# EAGLE board COM-TC (EAGLE 8.4.3), part 1 of 2
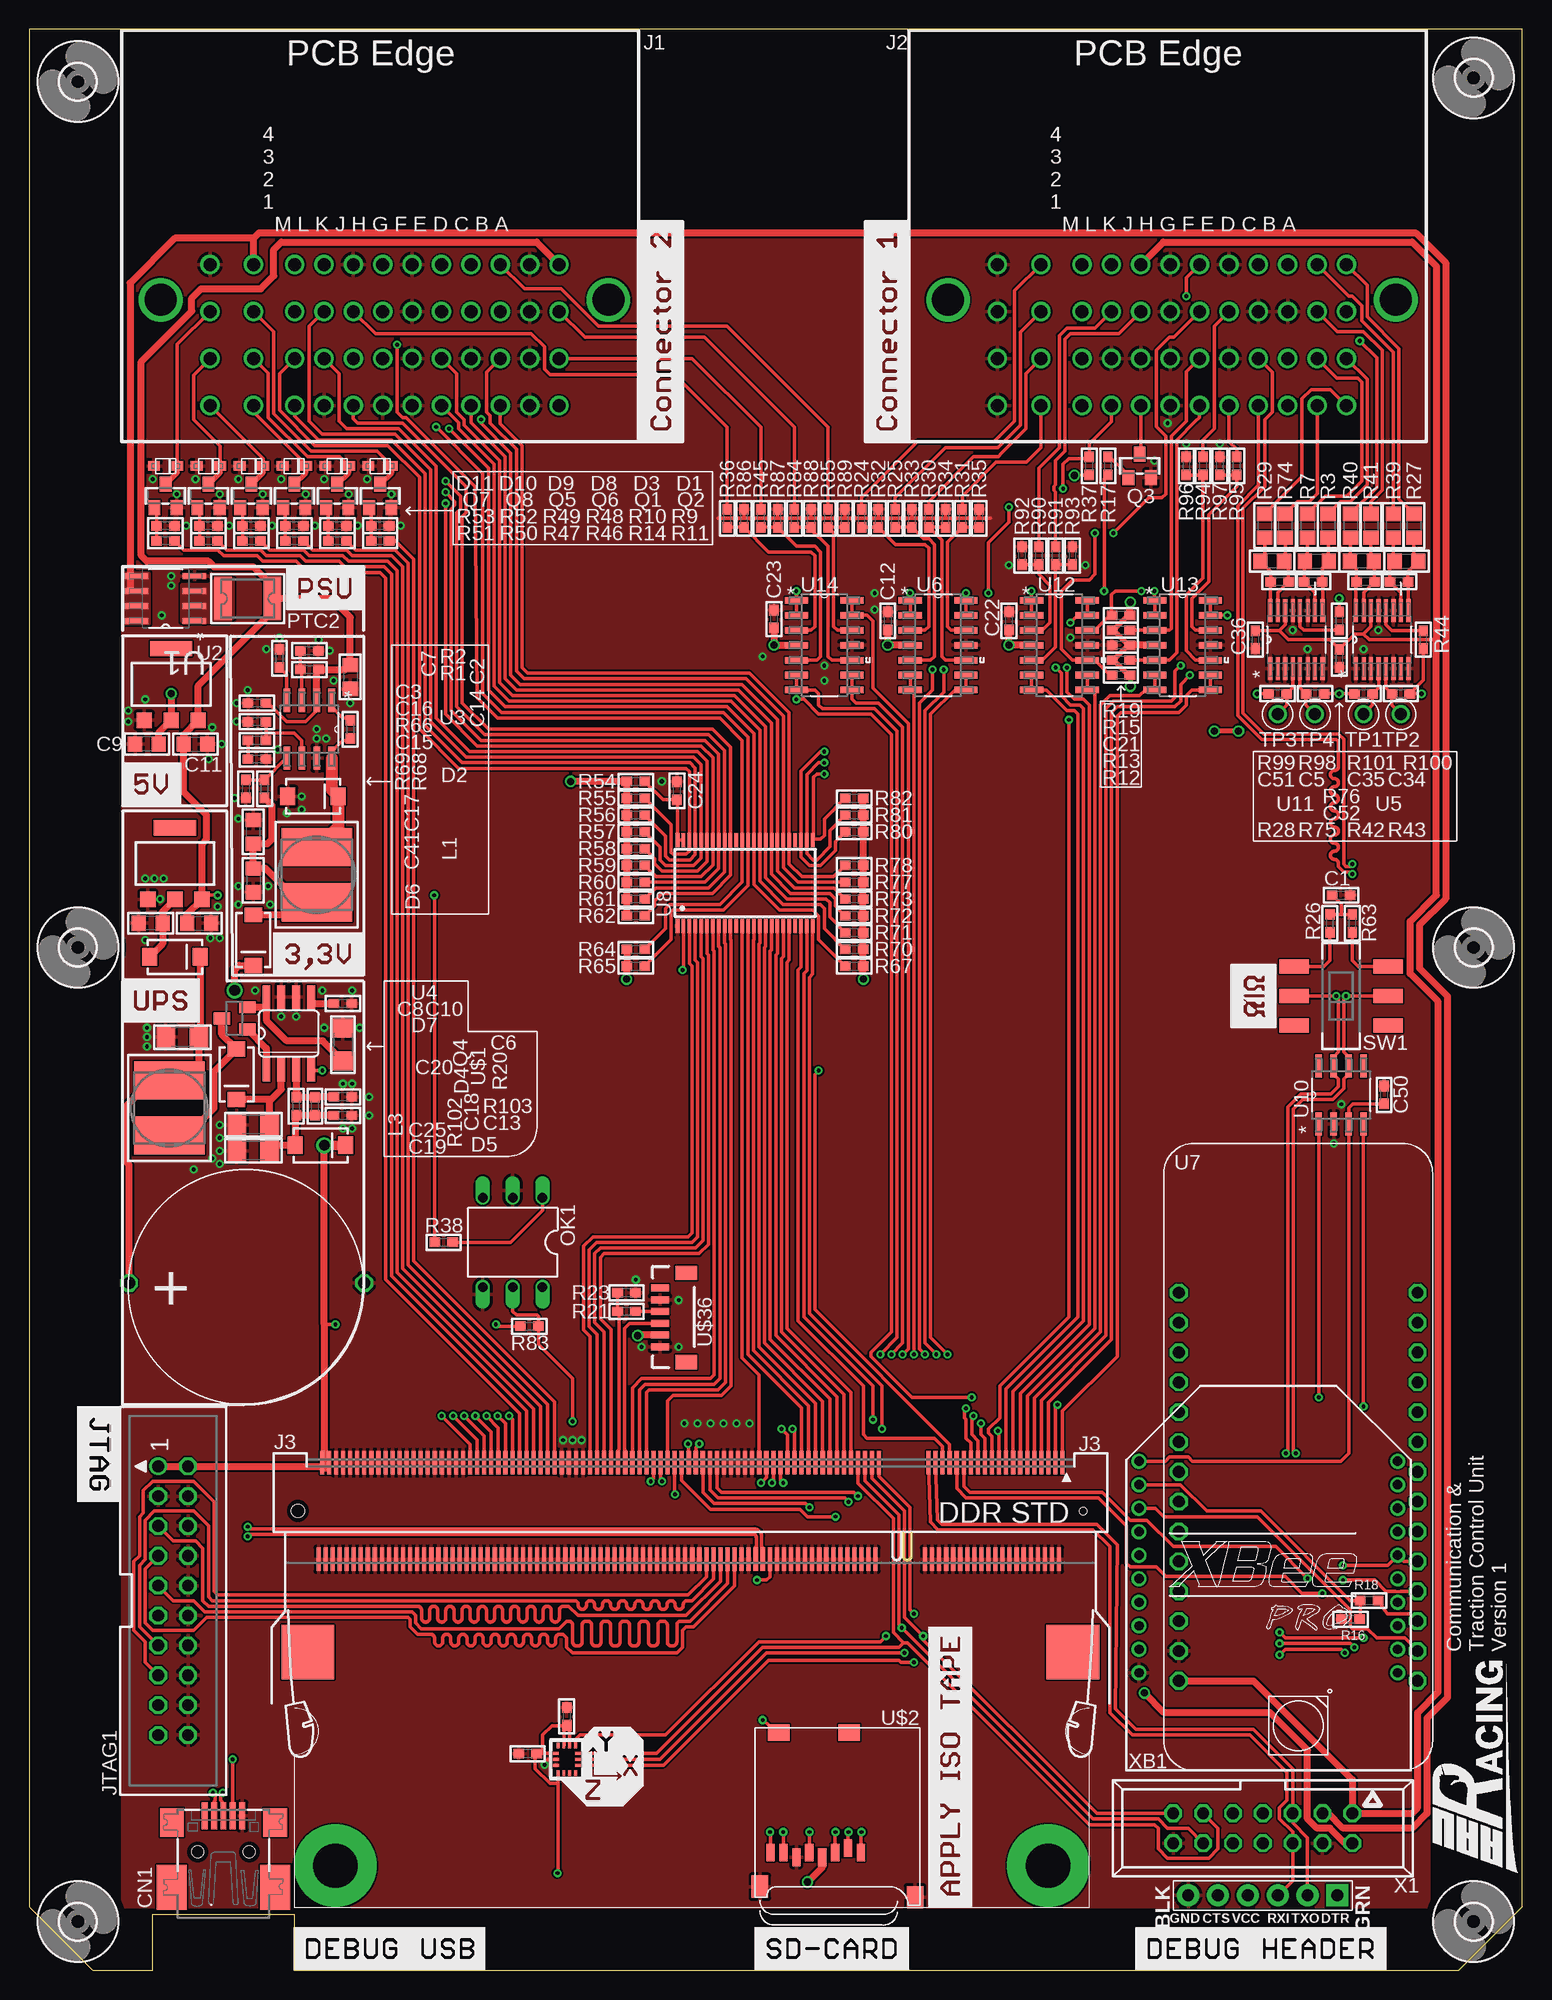
[diagram p4: board, top side]
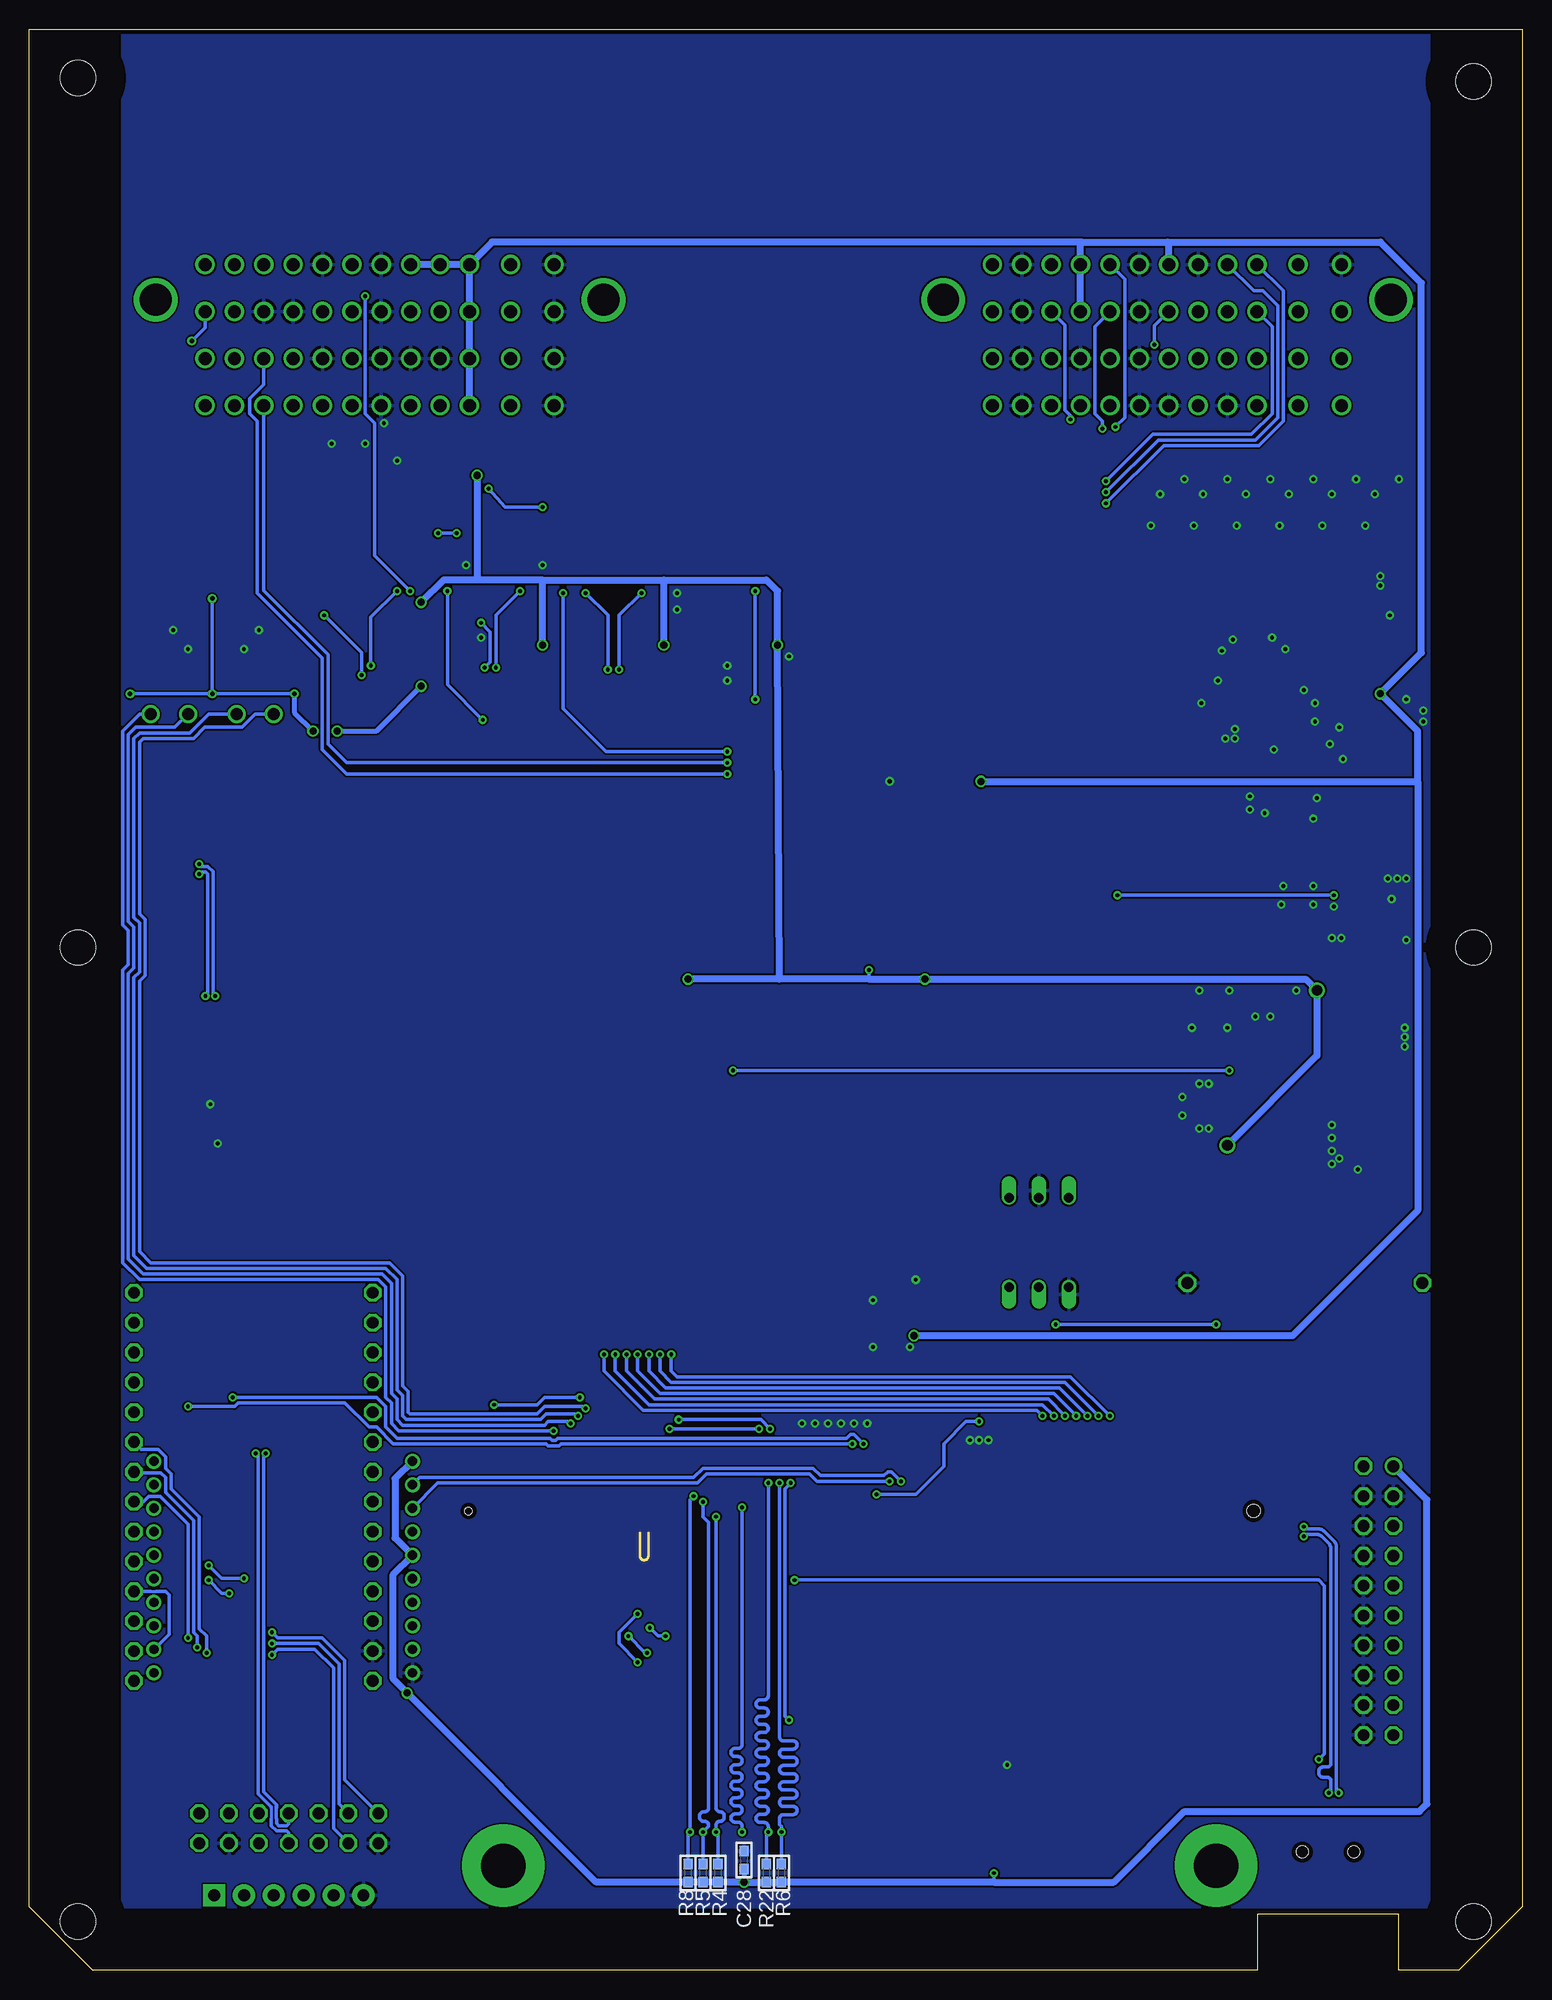
[diagram p5: board, bottom side, seen from below]

Size 127 x 165.1 mm. Coordinates in mm from the lower left corner, seen from the top.
Outline: 0,165.1 0,5.4 5.4,0 10.48,0 10.48,4.76 22.54,4.76 22.54,0 121.6,0 127,5.4 127,165.1 0,165.1
Copper layers (1*16): Top 0.0356mm / dielectric 1.5011mm / Bottom 0.0356mm
Design rules "LaenPCBOrder": minimum track width 6mil, minimum drill 13mil, track to track 6mil, track to pad 6mil, pad to pad 6mil, via to via 6mil, smd to smd 6mil, copper to edge 15mil, drill to drill 6mil, minimum pad ring 7mil, minimum via ring 7mil, stop-mask expansion 3mil, vias tented up to drill 0mil, thermal gap 10mil

## Footprints (pad centres in the part's own frame; a part is rotated, then mirrored left to right if it is on the bottom)
_0603 = smd 0.9 x 0.8: 1 -0.762,0; 2 0.762,0
_0805 = smd 1.2 x 1.3: 1 -1.016,0; 2 1.016,0
SUPERCAP = drill 1 octagon: P$1 -9.93,0.35; P$3 10.07,0.35
1206 = smd 1.6 x 1.8: 1 -1.4,0; 2 1.4,0
USB-MINIB_LARGER = smd 0.5 x 2.308: D+ 0,4.064; D- -0.8,4.064; GND 1.6,4.064; ID 0.8,4.064; VBUS -1.6,4.064 | smd 2.54 x 3.81: GND1 -4.4,-2; GND4 4.4,-2 | smd 2 x 2.4: GND2 -4.4,3.5; GND3 4.4,3.5 | hole 1: -2.2,1; 2.2,1
SOD-323F = smd 1 x 0.8: A -1,0; C 1,0
SMA-DIODE = smd 1.27 x 1.47: A -2.15,0; C 2.15,0
3,0 = hole 3: 0,0
AUTOCONNECTOR = drill 1.1: A1 15.22,-6.92; A2 15.22,-2.92; A3 15.22,1.08; A4 15.22,5.08; B1 12.72,-6.92; B2 12.72,-2.92; B3 12.72,1.08; B4 12.72,5.08; C1 10.22,-6.92; C2 10.22,-2.92; C3 10.22,1.08; C4 10.22,5.08; D1 7.72,-6.92; D2 7.72,-2.92; D3 7.72,1.08; D4 7.72,5.08; E1 5.22,-6.92; E2 5.22,-2.92; E3 5.22,1.08; E4 5.22,5.08; F1 2.72,-6.92; F2 2.72,-2.92; F3 2.72,1.08; F4 2.72,5.08; G1 0.22,-6.92; G2 0.22,-2.92; G3 0.22,1.08; G4 0.22,5.08; H1 -2.28,-6.92; H2 -2.28,-2.92; H3 -2.28,1.08; H4 -2.28,5.08; J1 -4.78,-6.92; J2 -4.78,-2.92; J3 -4.78,1.08; J4 -4.78,5.08; K1 -7.28,-6.92; K2 -7.28,-2.92; K3 -7.28,1.08; K4 -7.28,5.08; L1 -10.78,-6.92; L2 -10.78,-2.92; L3 -10.78,1.08; L4 -10.78,5.08; M1 -14.48,-6.92; M2 -14.48,-2.92; M3 -14.48,1.08; M4 -14.48,5.08 | drill 2.7: SHIELD1 19.42,2.08; SHIELD2 -18.68,2.08
SODIMM-CONNECTOR-2.5V = smd 0.35 x 2: 1 28.84,18.07; 2 28.54,9.87; 3 28.24,18.07; 4 27.94,9.87; 5 27.64,18.07; 6 27.34,9.87; 7 27.04,18.07; 8 26.74,9.87; 9 26.44,18.07; 10 26.14,9.87; 11 25.84,18.07; 12 25.54,9.87; 13 25.24,18.07; 14 24.94,9.87; 15 24.64,18.07; 16 24.34,9.87; 17 24.04,18.07; 18 23.74,9.87; 19 23.44,18.07; 20 23.14,9.87; 21 22.84,18.07; 22 22.54,9.87; 23 22.24,18.07; 24 21.94,9.87; 25 21.64,18.07; 26 21.34,9.87; 27 21.04,18.07; 28 20.74,9.87; 29 20.44,18.07; 30 20.14,9.87; 31 19.84,18.07; 32 19.54,9.87; 33 19.24,18.07; 34 18.94,9.87; 35 18.64,18.07; 36 18.34,9.87; 37 18.04,18.07; 38 17.74,9.87; 39 17.44,18.07; 40 17.14,9.87; 41 13.24,18.07; 42 12.94,9.87; 43 12.64,18.07; 44 12.34,9.87; 45 12.04,18.07; 46 11.74,9.87; 47 11.44,18.07; 48 11.14,9.87; 49 10.84,18.07; 50 10.54,9.87; 51 10.24,18.07; 52 9.94,9.87; 53 9.64,18.07; 54 9.34,9.87; 55 9.04,18.07; 56 8.74,9.87; 57 8.44,18.07; 58 8.14,9.87; 59 7.84,18.07; 60 7.54,9.87; 61 7.24,18.07; 62 6.94,9.87; 63 6.64,18.07; 64 6.34,9.87; 65 6.04,18.07; 66 5.74,9.87; 67 5.44,18.07; 68 5.14,9.87; 69 4.84,18.07; 70 4.54,9.87; 71 4.24,18.07; 72 3.94,9.87; 73 3.64,18.07; 74 3.34,9.87; 75 3.04,18.07; 76 2.74,9.87; 77 2.44,18.07; 78 2.14,9.87; 79 1.84,18.07; 80 1.54,9.87; 81 1.24,18.07; 82 0.94,9.87; 83 0.64,18.07; 84 0.34,9.87; 85 0.04,18.07; 86 -0.26,9.87; 87 -0.56,18.07; 88 -0.86,9.87; 89 -1.16,18.07; 90 -1.46,9.87; 91 -1.76,18.07; 92 -2.06,9.87; 93 -2.36,18.07; 94 -2.66,9.87; 95 -2.96,18.07; 96 -3.26,9.87; 97 -3.56,18.07; 98 -3.86,9.87; 99 -4.16,18.07; 100 -4.46,9.87; 101 -4.76,18.07; 102 -5.06,9.87; 103 -5.36,18.07; 104 -5.66,9.87; 105 -5.96,18.07; 106 -6.26,9.87; 107 -6.56,18.07; 108 -6.86,9.87; 109 -7.16,18.07; 110 -7.46,9.87; 111 -7.76,18.07; 112 -8.06,9.87; 113 -8.36,18.07; 114 -8.66,9.87; 115 -8.96,18.07; 116 -9.26,9.87; 117 -9.56,18.07; 118 -9.86,9.87; 119 -10.16,18.07; 120 -10.46,9.87; 121 -10.76,18.07; 122 -11.06,9.87; 123 -11.36,18.07; 124 -11.66,9.87; 125 -11.96,18.07; 126 -12.26,9.87; 127 -12.56,18.07; 128 -12.86,9.87; 129 -13.16,18.07; 130 -13.46,9.87; 131 -13.76,18.07; 132 -14.06,9.87; 133 -14.36,18.07; 134 -14.66,9.87; 135 -14.96,18.07; 136 -15.26,9.87; 137 -15.56,18.07; 138 -15.86,9.87; 139 -16.16,18.07; 140 -16.46,9.87; 141 -16.76,18.07; 142 -17.06,9.87; 143 -17.36,18.07; 144 -17.66,9.87; 145 -17.96,18.07; 146 -18.26,9.87; 147 -18.56,18.07; 148 -18.86,9.87; 149 -19.16,18.07; 150 -19.46,9.87; 151 -19.76,18.07; 152 -20.06,9.87; 153 -20.36,18.07; 154 -20.66,9.87; 155 -20.96,18.07; 156 -21.26,9.87; 157 -21.56,18.07; 158 -21.86,9.87; 159 -22.16,18.07; 160 -22.46,9.87; 161 -22.76,18.07; 162 -23.06,9.87; 163 -23.36,18.07; 164 -23.66,9.87; 165 -23.96,18.07; 166 -24.26,9.87; 167 -24.56,18.07; 168 -24.86,9.87; 169 -25.16,18.07; 170 -25.46,9.87; 171 -25.76,18.07; 172 -26.06,9.87; 173 -26.36,18.07; 174 -26.66,9.87; 175 -26.96,18.07; 176 -27.26,9.87; 177 -27.56,18.07; 178 -27.86,9.87; 179 -28.16,18.07; 180 -28.46,9.87; 181 -28.76,18.07; 182 -29.06,9.87; 183 -29.36,18.07; 184 -29.66,9.87; 185 -29.96,18.07; 186 -30.26,9.87; 187 -30.56,18.07; 188 -30.86,9.87; 189 -31.16,18.07; 190 -31.46,9.87; 191 -31.76,18.07; 192 -32.06,9.87; 193 -32.36,18.07; 194 -32.66,9.87; 195 -32.96,18.07; 196 -33.26,9.87; 197 -33.56,18.07; 198 -33.86,9.87; 199 -34.16,18.07; 200 -34.46,9.87 | smd 4.5 x 4.6: M1 29.74,1.97; M2 -35.36,1.97 | drill 3.75 pad 7: P$1 -33.02,-16.192; P$2 27.622,-16.192 | hole 0.6: 30.59,13.97 | hole 1.1: -36.21,13.97
FTDI_DEVICE_SIDE = drill 1.016 pad 1.88 square: P$1 -6.35,0 | drill 1.016 pad 1.88: P$2 -3.81,0; P$3 -1.27,0; P$4 1.27,0; P$5 3.81,0; P$6 6.35,0
JTAG-ARM = drill 1: 1 -11.43,-1.27 | drill 1 octagon: 2 -11.43,1.27; 3 -8.89,-1.27; 4 -8.89,1.27; 5 -6.35,-1.27; 6 -6.35,1.27; 7 -3.81,-1.27; 8 -3.81,1.27; 9 -1.27,-1.27; 10 -1.27,1.27; 11 1.27,-1.27; 12 1.27,1.27; 13 3.81,-1.27; 14 3.81,1.27; 15 6.35,-1.27; 16 6.35,1.27; 17 8.89,-1.27; 18 8.89,1.27; 19 11.43,-1.27; 20 11.43,1.27
INDUCTOR_6X6MM_TDK_VLC6045 = smd 3.25 x 6: P$1 -2.35,0; P$2 2.35,0
DIL06 = drill 0.813 offset: 1 -2.54,-3.81; 2 0,-3.81; 3 2.54,-3.81; 4 2.54,3.81; 5 0,3.81; 6 -2.54,3.81
PTC1812 = smd 1.5 x 3.7: P$1 -2.1,0; P$2 2.1,0
SOT23-WIDE = smd 1 x 1.27: 1 -0.95,-1; 2 0.95,-1; 3 0,1
SOT23 = smd 1 x 1.4: 1 -0.95,-1.1; 2 0.95,-1.1; 3 0,1.1
DPDT_SMT_JS202011SCQN = smd 1.2 x 2.5: P$1 -2.5,-4; P$2 0,-4; P$3 2.5,-4; P$4 2.5,4; P$5 0,4; P$6 -2.5,4
TESTPOINT_0.040IN = drill 1.016: TESTPOINT 0,0
SOIC127P600X175-8N = smd 1.981 x 0.508: 1 -2.464,1.905; 2 -2.464,0.635; 3 -2.464,-0.635; 4 -2.464,-1.905; 5 2.464,-1.905; 6 2.464,-0.635; 7 2.464,0.635; 8 2.464,1.905
SOT223-R = smd 1.3 x 1.3: 1 -2.3,-3.05; 2 0,-3.05; 3 2.3,-3.05 | smd 3.6 x 1.3: 4 0,3.05
SOIC127P600X175-8N' = smd 1.981 x 0.559: 1 -2.464,1.905; 2 -2.464,0.635; 3 -2.464,-0.635; 4 -2.464,-1.905; 5 2.464,-1.905; 6 2.464,-0.635; 7 2.464,0.635; 8 2.464,1.905
SOP63P600X175-16N = smd 1.981 x 0.356: 1 -2.464,2.235; 2 -2.464,1.575; 3 -2.464,0.965; 4 -2.464,0.305; 5 -2.464,-0.305; 6 -2.464,-0.965; 7 -2.464,-1.575; 8 -2.464,-2.235; 9 2.464,-2.235; 10 2.464,-1.575; 11 2.464,-0.965; 12 2.464,-0.305; 13 2.464,0.305; 14 2.464,0.965; 15 2.464,1.575; 16 2.464,2.235
SOIC127P600X175-14N = smd 1.981 x 0.559: 1 -2.362,3.81; 2 -2.362,2.54; 3 -2.362,1.27; 4 -2.362,0; 5 -2.362,-1.27; 6 -2.362,-2.54; 7 -2.362,-3.81; 8 2.362,-3.81; 9 2.362,-2.54; 10 2.362,-1.27; 11 2.362,0; 12 2.362,1.27; 13 2.362,2.54; 14 2.362,3.81
LOPY = drill 1 octagon: 3,3V 10.16,12.7; 5 10.16,-15.24; 5V 10.16,17.78; 6 10.16,-12.7; 7 10.16,-10.16; 8 10.16,-7.62; 9 -10.16,17.78; 10 10.16,-2.54; 11 10.16,-5.08; 12 10.16,0; 13 10.16,2.54; 14 10.16,7.62; 15 10.16,5.08; 16 -10.16,0; 17 10.16,10.16; 18 -10.16,-7.62; 20 -10.16,-10.16; 21 -10.16,5.08; 22 -10.16,-5.08; 23 -10.16,10.16; 24 -10.16,7.62; 34 -10.16,2.54; 38 -10.16,-2.54; 39 -10.16,-12.7; 40 -10.16,15.24; 41 -10.16,12.7; 42 -10.16,-15.24; GND 10.16,15.24
TSSOP48 = smd 0.3 x 1.2: 1 -5.5,-3.4; 2 -5,-3.4; 3 -4.5,-3.4; 4 -4,-3.4; 5 -3.5,-3.4; 6 -3,-3.4; 7 -2.5,-3.4; 8 -2,-3.4; 9 -1.5,-3.4; 10 -1,-3.4; 11 -0.5,-3.4; 12 0,-3.4; 13 0.5,-3.4; 14 1,-3.4; 15 1.5,-3.4; 16 2,-3.4; 17 2.5,-3.4; 18 3,-3.4; 19 3.5,-3.4; 20 4,-3.4; 21 4.5,-3.4; 22 5,-3.4; 23 5.5,-3.4; 24 6,-3.4; 25 6,3.9; 26 5.5,3.9; 27 5,3.9; 28 4.5,3.9; 29 4,3.9; 30 3.5,3.9; 31 3,3.9; 32 2.5,3.9; 33 2,3.9; 34 1.5,3.9; 35 1,3.9; 36 0.5,3.9; 37 0,3.9; 38 -0.5,3.9; 39 -1,3.9; 40 -1.5,3.9; 41 -2,3.9; 42 -2.5,3.9; 43 -3,3.9; 44 -3.5,3.9; 45 -4,3.9; 46 -4.5,3.9; 47 -5,3.9; 48 -5.5,3.9
LGA14L_DOT_INDICATOR = smd 0.45 x 0.25: 1 -1.175,0.75; 2 -1.175,0.25; 3 -1.175,-0.25; 4 -1.175,-0.75; 8 1.175,-0.75; 9 1.175,-0.25; 10 1.175,0.25; 11 1.175,0.75 | smd 0.25 x 0.45: 5 -0.5,-0.925; 6 0,-0.925; 7 0.5,-0.925; 12 0.5,0.925; 13 0,0.925; 14 -0.5,0.925
SO08 = smd 0.66 x 2.032: 1 -1.905,-3.073; 2 -0.635,-3.073; 3 0.635,-3.073; 4 1.905,-3.073; 5 1.905,3.073; 6 0.635,3.073; 7 -0.635,3.073; 8 -1.905,3.073
MICROSD = smd 0.7 x 1.5: 1 9,-10.64; 2 7.9,-10.24; 3 6.8,-10.64; 4 5.7,-11.04; 5 4.6,-10.64; 6 3.5,-11.04; 7 2.4,-10.64; 8 1.3,-10.64 | smd 1.8 x 1.4: CD1 2,-0.44; CD2 8,-0.44 | smd 1.4 x 1.9: MT1 0.4,-13.54; MT2 13.6,-14.44
EM406 = smd 0.6 x 1.55: 1 0,0; 2 1,0; 3 2,0; 4 3,0; 5 4,0; 6 5,0 | smd 1.2 x 1.8: P$1 -1.3,-2.225; P$2 6.3,-2.225
057-014-1 = drill 1 octagon: 1 -7.62,-1.27; 2 -7.62,1.27; 3 -5.08,-1.27; 4 -5.08,1.27; 5 -2.54,-1.27; 6 -2.54,1.27; 7 0,-1.27; 8 0,1.27; 9 2.54,-1.27; 10 2.54,1.27; 11 5.08,-1.27; 12 5.08,1.27; 13 7.62,-1.27; 14 7.62,1.27
XBEE-PRO = drill 0.8 pad 1.27: 1 -11,9; 2 -11,7; 3 -11,5; 4 -11,3; 5 -11,1; 6 -11,-1; 7 -11,-3; 8 -11,-5; 9 -11,-7; 10 -11,-9; 11 11,-9; 12 11,-7; 13 11,-5; 14 11,-3; 15 11,-1; 16 11,1; 17 11,3; 18 11,5; 19 11,7; 20 11,9

## Placement (x,y rotation side)
C1  47n  [_0603]  111.6,91.44 180 top
C2  4,7u  [_0805]  27.3,110.01 270 top
C3  10n  [_0603]  19.37,107.79 180 top
C4  SUPERCAP  [SUPERCAP]  18.41,58.1 0 top
C5  1n  [_0603]  109.22,118.11 180 top
C6  100n  [_0603]  26.67,82.23 0 top
C7  10n  [_0603]  21.27,111.6 90 top
C8  22u  [_0805]  10.32,89.06 180 top
C9  22u  [_0805]  10,104.3 180 top
C10  10u  [_0805]  14.45,89.06 0 top
C11  10u  [_0805]  14.13,104.3 0 top
C12  100n  [_0603]  73.03,114.78 270 top
C13  100n  [_0603]  26.67,72.71 0 top
C14  100n  [_0603]  27.3,105.57 90 top
C15  1n  [_0603]  19.37,104.62 180 top
C16  47p  [_0603]  19.37,106.2 180 top
C17  47u  [_0805]  19.05,96.84 90 top
C18  47p  [_0603]  24.29,73.5 270 top
C19  100u 6v3  [1206]  19.05,69.69 180 top
C20  150u 6v3  [1206]  13.02,79.38 180 top
C21  100n  [_0603]  92.87,112.71 0 top
C22  100n  [_0603]  83.34,114.78 270 top
C23  100n  [_0603]  63.34,114.94 270 top
C24  100n  [_0603]  55.09,100.33 90 top
C25  100u 6v3  [1206]  19.05,71.91 180 top
C26  100n  [_0603]  42.39,18.41 180 top
C27  100n  [_0603]  45.72,21.59 90 top
C28  100n  [_0603]  66.2,9.37 90 bottom
C34  1n  [_0603]  116.52,118.11 180 top
C35  1n  [_0603]  113.67,118.11 0 top
C36  100n  [_0603]  104.3,113.19 270 top
C41  47u  [_0805]  19.05,92.71 270 top
C50  100n  [_0603]  115.25,74.45 90 top
C51  1n  [_0603]  106.36,118.11 0 top
C52  100n  [_0603]  111.44,111.6 270 top
CN1  [USB-MINIB_LARGER]  16.51,9.05 0 top
D1  [SOD-323F]  29.84,127.95 0 top
D2  BA340A  [SMA-DIODE]  24.13,99.85 0 top
D3  [SOD-323F]  26.19,127.95 0 top
D4  BA340A  [SMA-DIODE]  17.62,76.2 270 top
D5  BA340A  [SMA-DIODE]  24.77,70.17 0 top
D6  BA340A  [SMA-DIODE]  19.05,87.63 270 top
D7  BA340A  [SMA-DIODE]  12.38,86.2 0 top
D8  [SOD-323F]  22.54,127.95 0 top
D9  [SOD-323F]  18.89,127.95 0 top
D10  [SOD-323F]  15.24,127.95 0 top
D11  [SOD-323F]  11.59,127.95 0 top
H1  MOUNT-HOLE3.0  [3,0]  4.13,160.66 0 top
H2  MOUNT-HOLE3.0  [3,0]  4.13,87 0 top
H3  MOUNT-HOLE3.0  [3,0]  4.13,4.13 0 top
H4  MOUNT-HOLE3.0  [3,0]  122.87,4.13 0 top
H5  MOUNT-HOLE3.0  [3,0]  122.87,160.97 0 top
H6  MOUNT-HOLE3.0  [3,0]  122.87,87 0 top
J1  CON1  [AUTOCONNECTOR]  29.84,140.02 0 top
J2  CON1  [AUTOCONNECTOR]  96.84,140.02 0 top
J3  SO-DIMM-CPU  [SODIMM-CONNECTOR-2.5V]  59.05,25.08 0 top
J4  FTDI_DEVICE  [FTDI_DEVICE_SIDE]  104.93,6.35 180 top
JTAG1  JTAG-ARM  [JTAG-ARM]  12.22,31.43 270 top
L1  SRN6045TA-680M  [INDUCTOR_6X6MM_TDK_VLC6045]  24.45,93.19 270 top
L3  SRN6045TA-220M  [INDUCTOR_6X6MM_TDK_VLC6045]  11.91,73.34 270 top
OK1  4N33  [DIL06]  41.12,61.91 180 top
PTC2  [PTC1812]  18.57,116.68 180 top
Q1  [SOT23-WIDE]  26.19,125.41 0 top
Q2  [SOT23-WIDE]  29.84,125.41 0 top
Q3  [SOT23-WIDE]  94.46,127.95 0 top
Q4  PMV20XNE  [SOT23]  17.46,80.96 90 top
Q5  [SOT23-WIDE]  18.89,125.41 0 top
Q6  [SOT23-WIDE]  22.54,125.41 0 top
Q7  [SOT23-WIDE]  11.59,125.41 0 top
Q8  [SOT23-WIDE]  15.24,125.41 0 top
R1  332k  [_0603]  23.81,110.65 180 top
R2  68k1  [_0603]  23.81,112.24 0 top
R3  10k 0W5  [_0805]  110.49,122.87 270 top
R4  4k7  [_0603]  68.42,8.26 90 bottom
R5  4k7  [_0603]  69.69,8.26 90 bottom
R6  4k7  [_0603]  63.02,8.26 90 bottom
R7  10k 0W5  [_0805]  108.74,122.87 270 top
R8  4k7  [_0603]  70.96,8.26 90 bottom
R9  500  [_0603]  29.84,122.87 0 top
R10  500  [_0603]  26.19,122.87 0 top
R11  220  [_0603]  29.84,121.6 0 top
R12  10k  [_0603]  92.87,110.17 180 top
R13  10k  [_0603]  92.87,111.44 0 top
R14  220  [_0603]  26.19,121.6 0 top
R15  10k  [_0603]  92.87,113.98 0 top
R16  976  [_0603]  112.39,29.84 180 top
R17  500  [_0603]  91.76,127.95 270 top
R18  499  [_0603]  113.98,31.43 0 top
R19  10k  [_0603]  92.87,115.25 180 top
R20  35m  [1206]  26.67,78.74 270 top
R21  499  [_0603]  50.8,56.04 0 top
R22  4k7  [_0603]  64.29,8.26 90 bottom
R23  976  [_0603]  50.8,57.63 180 top
R24  20k  [_0603]  70.8,123.51 270 top
R25  20k  [_0603]  73.66,123.51 270 top
R26  60  [_0603]  110.65,89.06 270 top
R27  10k 0W5  [_0805]  117.79,122.87 270 top
R28  1k  [_0603]  106.2,108.58 180 top
R29  10k 0W5  [_0805]  105.09,122.87 270 top
R30  20k  [_0603]  76.52,123.51 270 top
R31  20k  [_0603]  79.38,123.51 270 top
R32  38k2  [_0603]  72.23,123.51 270 top
R33  38k2  [_0603]  75.09,123.51 270 top
R34  38k2  [_0603]  77.95,123.51 270 top
R35  38k2  [_0603]  80.8,123.51 270 top
R36  20k  [_0603]  59.37,123.51 270 top
R37  10k  [_0603]  90.17,127.95 90 top
R38  560  [_0603]  35.24,61.91 0 top
R39  10k 0W5  [_0805]  116.05,122.87 270 top
R40  10k 0W5  [_0805]  112.39,122.87 270 top
R41  10k 0W5  [_0805]  114.14,122.87 270 top
R42  1k  [_0603]  113.51,108.58 180 top
R43  1k  [_0603]  116.68,108.58 0 top
R44  1k  [_0603]  118.59,113.19 270 top
R45  20k  [_0603]  62.23,123.51 270 top
R46  220  [_0603]  22.54,121.6 0 top
R47  220  [_0603]  18.89,121.6 0 top
R48  500  [_0603]  22.54,122.87 0 top
R49  500  [_0603]  18.89,122.87 0 top
R50  220  [_0603]  15.24,121.6 0 top
R51  220  [_0603]  11.59,121.6 0 top
R52  500  [_0603]  15.24,122.87 0 top
R53  500  [_0603]  11.59,122.87 0 top
R54  200k  [_0603]  51.59,101.12 180 top
R55  220  [_0603]  51.59,99.69 0 top
R56  220  [_0603]  51.59,98.27 0 top
R57  220  [_0603]  51.59,96.84 0 top
R58  220  [_0603]  51.59,95.41 0 top
R59  220  [_0603]  51.59,93.98 0 top
R60  220  [_0603]  51.59,92.55 0 top
R61  220  [_0603]  51.59,91.12 0 top
R62  220  [_0603]  51.59,89.69 0 top
R63  60  [_0603]  112.55,89.06 90 top
R64  220  [_0603]  51.59,86.84 0 top
R65  220  [_0603]  51.59,85.41 0 top
R66  29k4  [_0603]  19.37,103.03 0 top
R67  220  [_0603]  70.17,85.41 180 top
R68  10k2  [_0603]  20,100.49 90 top
R69  2k7  [_0603]  18.41,100.49 270 top
R70  220  [_0603]  70.17,86.84 180 top
R71  220  [_0603]  70.17,88.27 180 top
R72  220  [_0603]  70.17,89.69 180 top
R73  220  [_0603]  70.17,91.12 180 top
R74  10k 0W5  [_0805]  106.84,122.87 270 top
R75  1k  [_0603]  109.38,108.58 0 top
R76  1k  [_0603]  111.44,114.78 90 top
R77  220  [_0603]  70.17,92.55 180 top
R78  220  [_0603]  70.17,93.98 180 top
R80  220  [_0603]  70.17,96.84 180 top
R81  220  [_0603]  70.17,98.27 180 top
R82  220  [_0603]  70.17,99.69 180 top
R83  500  [_0603]  42.55,54.77 0 top
R84  20k  [_0603]  65.09,123.51 270 top
R85  20k  [_0603]  67.94,123.51 270 top
R86  38k2  [_0603]  60.8,123.51 270 top
R87  38k2  [_0603]  63.66,123.51 270 top
R88  38k2  [_0603]  66.52,123.51 270 top
R89  38k2  [_0603]  69.37,123.51 270 top
R90  20k  [_0603]  85.88,120.33 270 top
R91  20k  [_0603]  87.31,120.33 270 top
R92  38k2  [_0603]  84.45,120.33 270 top
R93  38k2  [_0603]  88.74,120.33 270 top
R94  20k  [_0603]  99.85,127.95 270 top
R95  20k  [_0603]  102.71,127.95 270 top
R96  38k2  [_0603]  98.42,127.95 270 top
R97  38k2  [_0603]  101.28,127.95 270 top
R98  10k 0W5  [_0805]  109.54,119.86 0 top
R99  10k 0W5  [_0805]  105.73,119.86 180 top
R100  10k 0W5  [_0805]  117.16,119.86 0 top
R101  10k 0W5  [_0805]  113.35,119.86 180 top
R102  70k  [_0603]  22.7,73.5 270 top
R103  50k  [_0603]  26.67,74.3 180 top
SW1  [DPDT_SMT_JS202011SCQN]  111.6,82.87 90 top
TP1  TEST_POINT_0.040IN  [TESTPOINT_0.040IN]  113.51,106.84 180 top
TP2  TEST_POINT_0.040IN  [TESTPOINT_0.040IN]  116.68,106.84 180 top
TP3  TEST_POINT_0.040IN  [TESTPOINT_0.040IN]  106.2,106.84 180 top
TP4  TEST_POINT_0.040IN  [TESTPOINT_0.040IN]  109.38,106.84 180 top
U1  IRF9332PBF  [SOIC127P600X175-8N]  11.59,116.68 180 top
U2  5V  [SOT223-R]  12.06,109.38 0 top
U3  TPS54331D  [SOIC127P600X175-8N']  23.81,105.57 270 top
U4  3,3V  [SOT223-R]  12.38,94.14 0 top
U5  MAX9926  [SOP63P600X175-16N]  115.09,113.19 90 top
U6  MCP6004-E/SL  [SOIC127P600X175-14N]  77.31,112.71 0 top
U7  LoPy  [LOPY]  107.95,42.39 180 top
U8  GTL2000  [TSSOP48]  60.64,92.23 0 top
U9  LSM6DS3  [LGA14L_DOT_INDICATOR]  45.72,17.94 270 top
U10  SN65HVD232D  [SOIC127P600X175-8N']  111.6,74.45 90 top
U11  MAX9926  [SOP63P600X175-16N]  107.79,113.19 90 top
U12  MCP6004-E/SL  [SOIC127P600X175-14N]  87.63,112.71 0 top
U13  MCP6004-E/SL  [SOIC127P600X175-14N]  98.11,112.71 0 top
U14  MCP6004-E/SL  [SOIC127P600X175-14N]  67.63,112.71 0 top
U$1  MAX608ESA+  [SO08]  22.07,79.69 0 top
U$2  MICROSD  [MICROSD]  61.75,20.64 0 top
U$36  EM406  [EM406]  53.66,53.02 90 top
X1  057-014-1  [057-014-1]  104.93,12.06 180 top
XB1  XBEE-PRO  [XBEE-PRO]  105.41,34.29 0 top